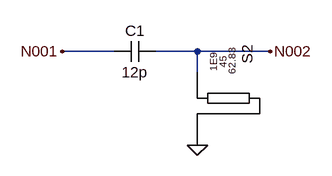
[diagram p0: schematic PasaAltasStubInductor.asc]
PasaAltasStubInductor.asc, the LTspice schematic file:
Version 4
SHEET 1 880 680
WIRE 96 112 16 112
WIRE 224 112 160 112
WIRE 336 112 224 112
WIRE 224 144 224 112
FLAG 224 256 0
FLAG 336 112 N002
FLAG 16 112 N001
SYMBOL cap 96 128 R270
WINDOW 0 32 32 VTop 2
WINDOW 3 0 32 VBottom 2
SYMATTR InstName C1
SYMATTR Value 12p
SYMBOL SSC 272 208 R90
SYMATTR SpiceModel 62.83
SYMATTR Value 45
SYMATTR Value2 1E9
SYMATTR InstName S2

The netlist it stands for:
* PasaAltasStubInductor.asc
C1 N001 N002 12p
S2 N002 0 62.83 45 1E9
.backanno
.end